# EAGLE design MeshPi (EAGLE 7.7.0)
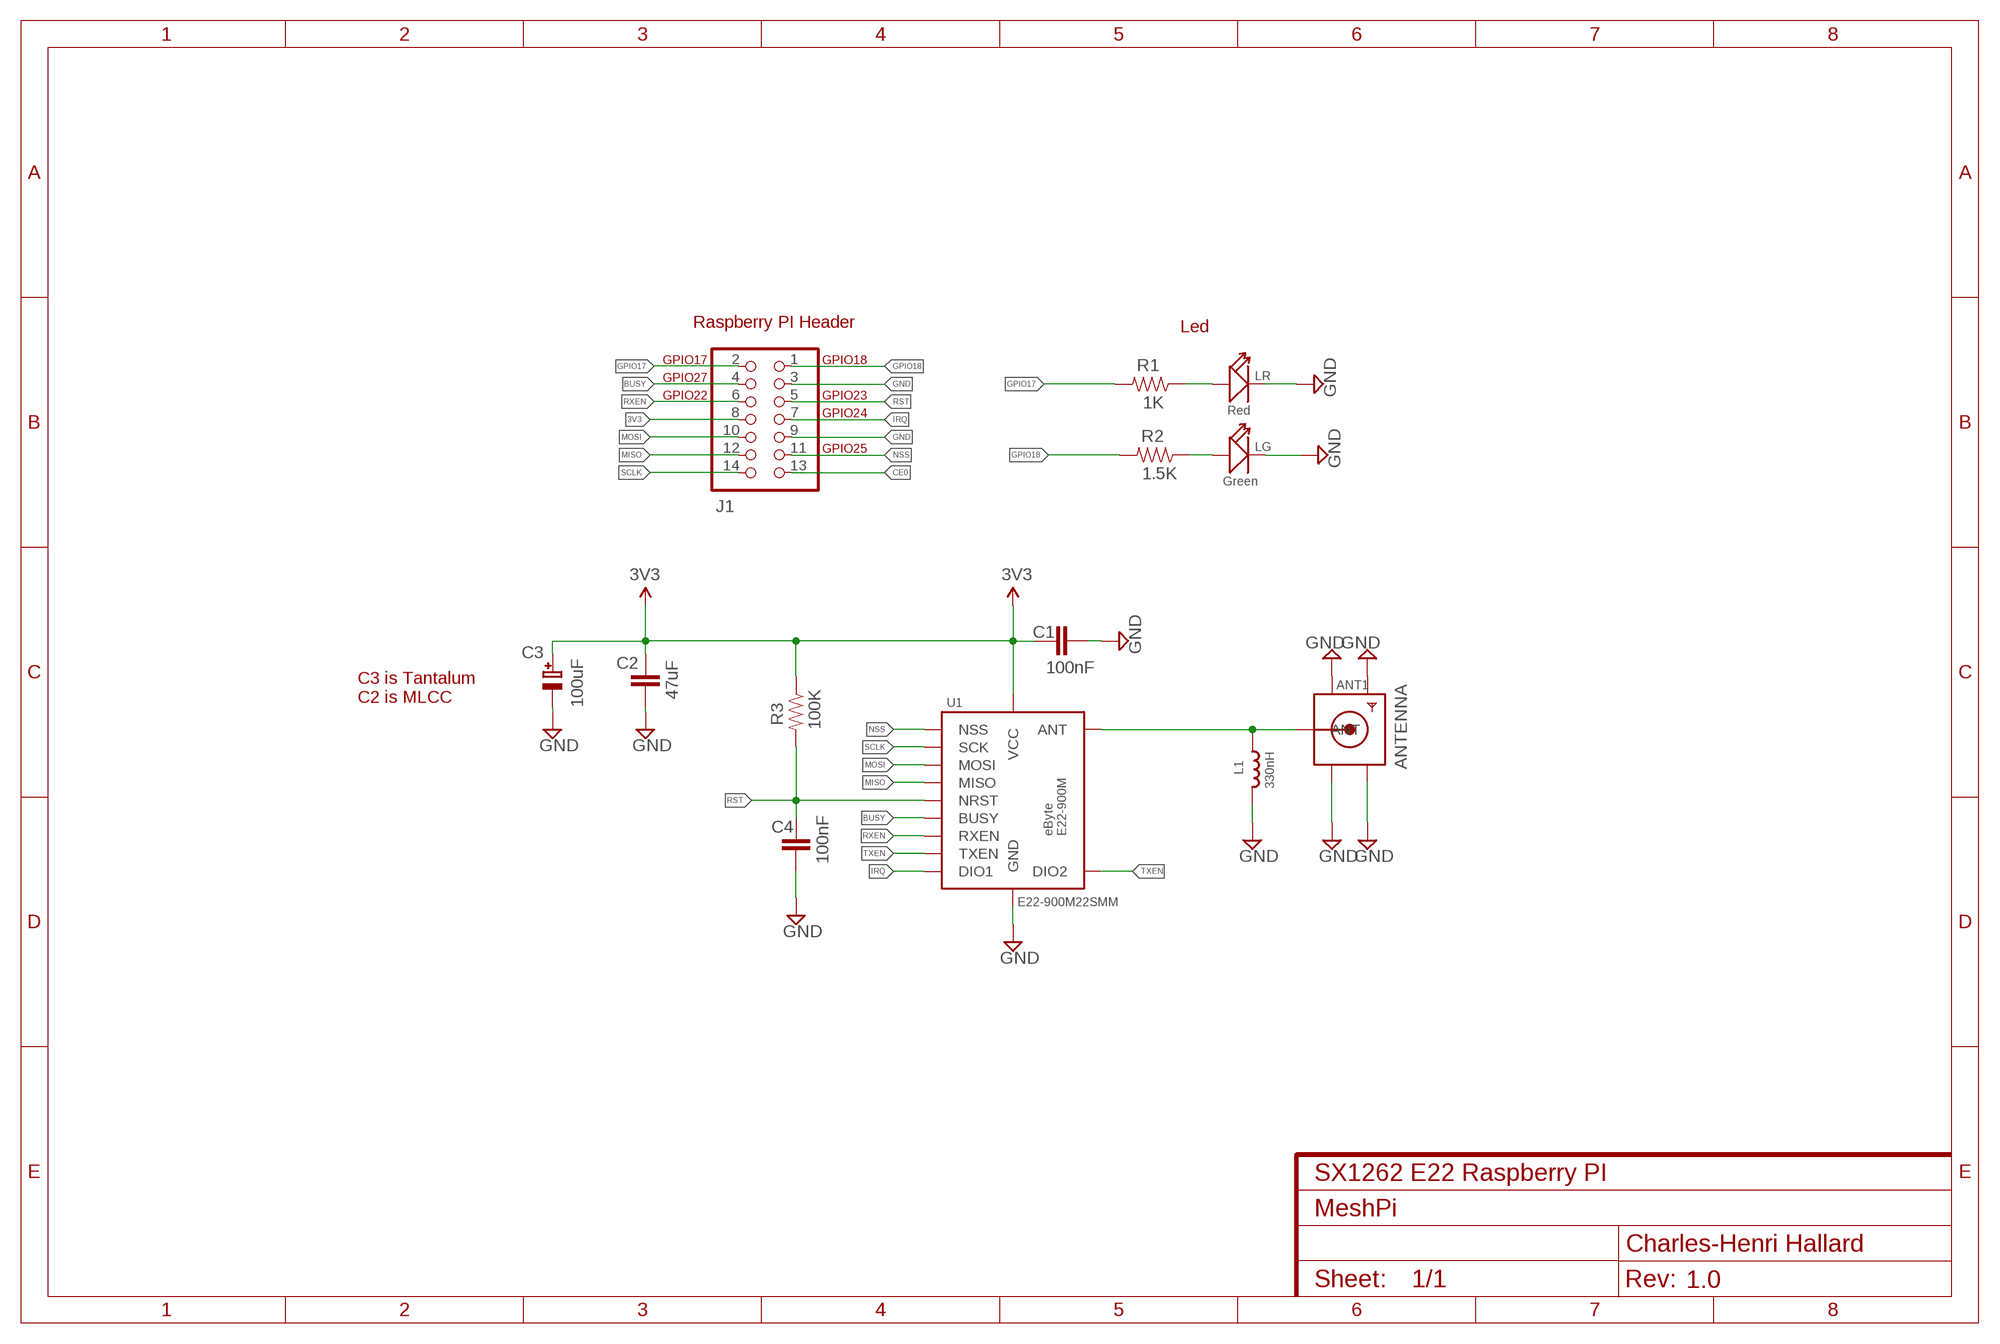
[diagram p0: schematic, sheet 1]
NAME (FRAME-A4L): CNAME: SX1262 E22 Raspberry PI; CREVISION: 1.0; DESIGNER: Charles-Henri Hallard

## Parts
ANT1  SMACONNECTOR_EDGE_UFL  [SMA_EDGELAUNCH_UFL]
C1  100nF  CAP0402-CAP  [0402-CAP]
C2  47uF  CAP1206  [1206]
C3  100uF  CAP_TANTALUMB/3528_REFLOW  [EIA3528-21/B-R]
C4  100nF  CAP0402-CAP  [0402-CAP]
J1  PINHD-2X7  [2X07]
L1  330nH  INDUCTOR_0603MP  [_0603MP]
LG  Green  SMD-LED-CLEAR-BLUE(0402)  [LED-0402]
LR  Red  SMD-LED-CLEAR-BLUE(0402)  [LED-0402]
R1  1K  RESISTOR0402-RES  [0402-RES]
R2  1.5K  RESISTOR0402-RES  [0402-RES]
R3  100K  RESISTOR0402-RES  [0402-RES]
U1  E22-900M22SMM  [E22-900MM2S]

## Nets
3V3: C1.2 C2.2 C3.+ J1.8 R3.1 U1.P$1(VCC)
ANTENNA: ANT1.P(ANT) L1.1 U1.P$6(ANT)
BUSY: J1.4 U1.P$11(BUSY)
CE0: J1.13
GND: ANT1.GND@1(GND1) ANT1.GND@2(GND2) ANT1.GND@3(GND3) ANT1.GND@4(GND4) C1.1 C2.1 C3.- C4.1 J1.3 J1.9 L1.2 LG.- LR.- U1.P$2(GND) U1.P$7(GND) U1.P$16(GND)
GPIO17: J1.2 R1.2
GPIO18: J1.1 R2.2
IRQ: J1.7 U1.P$20(DIO1)
MISO: J1.12 U1.P$12(MISO)
MOSI: J1.10 U1.P$13(MOSI)
N$1: LR.+ R1.1
N$2: LG.+ R2.1
NSS: J1.11 U1.P$14(NSS)
RST: C4.2 J1.5 R3.2 U1.P$3(NRST)
RXEN: J1.6 U1.P$10(RXEN)
SCLK: J1.14 U1.P$15(SCK)
TXEN: U1.P$9(TXEN) U1.P$19(DIO2)

## Notes on the sheet
- Raspberry PI Header | Led
- GPIO17 | GPIO18
- GPIO27
- GPIO22 | GPIO23
- GPIO24
- GPIO25
- C3 is Tantalum
  C2 is MLCC

## Library data of the parts
ANT1 = adafruit:SMACONNECTOR: SMA Connector 90° DIP SMA Connector, 50 Ohm (4UConnector: 07259)
C1 C2 C4 = _c2h:CAP: Capacitor Standard 0603 ceramic capacitor, and 0.1" leaded capacitor.
C3 = microbuilder:CAP_TANTALUM: Tantalum Capacitors Wave footprints have larger pads and are meant to be used for hand soldering. Reflow footprints are optimised for solder paste and a reflow oven. EIA3216-18/A-[R/W] - Size A / 3216-18 / 1206 footprint 4.7µF 25V 10% Tantalum Capacitor 10µF 16V 10% Tantalum Capacitor [Digikey: 495-2236-2-ND] EIA3528-21/B-[R/W] - Size B / 3528-21 47µF 10V 10% Tantalum Capactior [Digikey: 495-2216-1-ND] EIA6032-28/C-[R/W] - Size C / 6032-28 10µF 35V 20% Tantalum Capacitor [Digikey: 495-2285-1-ND] 100µF 16V 10% Tantalum Capactior [Digikey: 399-5214-1-ND]
J1 = pinhead:PINHD-2X7: PIN HEADER
L1 = microbuilder:INDUCTOR: Inductors 0603: 10nH Ceramic Inductor - microwire antenna/RF (Digikey: 712-1434-2-ND) 0805: 560nH Ceramic Inductor - RF (Digikey: 553-1047-1-ND) 270nH Ceramic Inductor - Q = 40@250MHz, +-5%, 1 Ohm DC Resistance (Digikey: 535-10506-2-ND) 1007 (2518 Metric) SMT: 10µH 10% 250mOhm 820mA 1007 Inductor (Digikey: 587-2189-1-ND) 22µH 10% 500mOhm 580mA 1007 Inductor (Digikey: 587-2190-1-ND) 47µH 10% 950mOhm 420mA 1007 Inductor (Digikey: 587-2191-1-ND) 47µH 5% 100mOhm 1A 1008 Inductor (Digikey: 732-1816-1-ND) 5.0x5.0mm (Taiyo Yuden NR5040 Series) 6.8µH 20% 2.3A 64mOhm Inductor (Digikey: 587-2374-2-ND) 5.0x5.0mm (TDK VLC5045 Series) 4.7µH 20% 3.3A 34mOhm Inductor (Digikey: 445-6526-1-ND) 6.8µH 20% 2.7A 46mOhm Inductor (Digikey: 445-6527-1-ND) 6.0x6.0mm (TDK VLC6045 Series) 4.7µH 20% 3.8A 27mOhm Inductor (Digikey: 445-6538-2-ND) 6.8µH 20% 3A 41mOhm Inductor (Digikey: 445-6540-1-ND) 6.2µH 30% 2.2A 45mOhm Inductor (Digikey: SRR5028-6R2YCT-ND) - Not TDK VLC6045 but footprint should match 6.0x6.0mm (TDK SLF6045 Series) 6.8uH 30% 2A 33mOhm Inductor (Digikey: 445-4572-1-ND, Mouser: 810-SLF645T6R8N2R0PF)
LG LR = OPL_Optoelectronics:SMD-LED-CLEAR-BLUE(0402): 304090075; MPN: BL-HB337A-AV-TRB; VALUE: BLUE-0402
R1-R3 = _c2h:RESISTOR: Resistor Basic schematic elements and footprints for 0603, 1206, and PTH resistors.
U1 = E22-900M22S:E22-900M22S: Check availability <https://pricing.snapeda.com/parts/E22-900M22S/EBYTE/view-part?ref=eda>

## Board
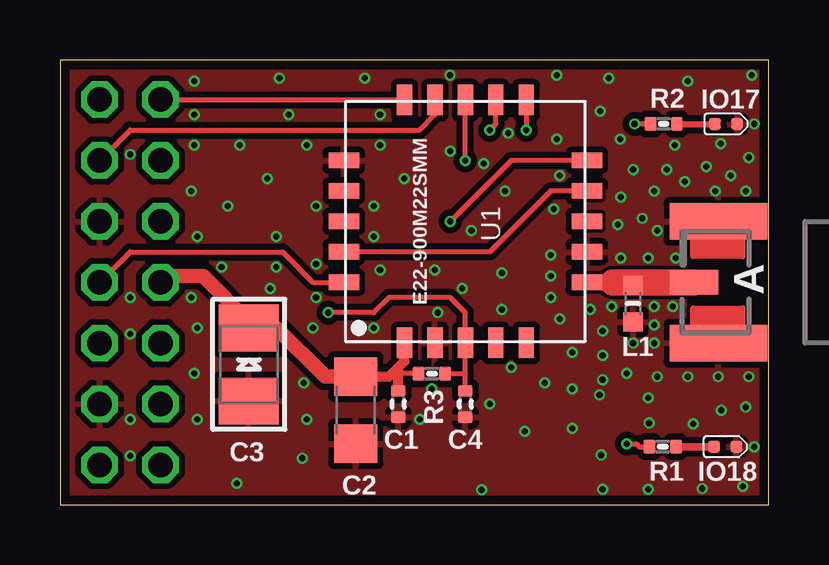
[diagram p1: board, top side]
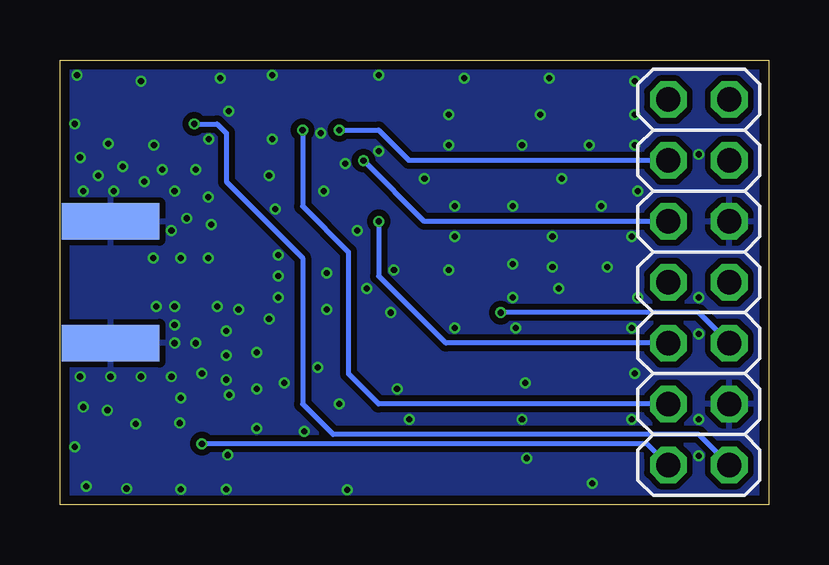
[diagram p2: board, bottom side, seen from below]

Size 29.54 x 18.54 mm. Coordinates in mm from the lower left corner, seen from the top.
Outline: 0,0 29.54,0 29.54,18.54 0,18.54 0,0
Copper layers (1*16): Top 0.035559375mm / dielectric 0.17018125mm / Bottom 0.035559375mm
Design rules "oshpark-4layer-tented *": minimum track width 5mil, minimum drill 10mil, track to track 5mil, track to pad 5mil, pad to pad 5mil, via to via 5mil, smd to smd 5mil, copper to edge 15mil, drill to drill 6mil, minimum pad ring 4mil, minimum via ring 4mil, stop-mask expansion 1.5mil, vias tented up to drill 20mil, thermal gap 10mil

### Footprints (pad centres in the part's own frame; a part is rotated, then mirrored left to right if it is on the bottom)
SMA_EDGELAUNCH_UFL = smd 4.064 x 1.524: GND@1 2.032,-2.54; GND@2 2.032,2.54 | smd 4.064 x 1.524 bottom: GND@3 2.032,2.54; GND@4 2.032,-2.54 | smd 2.032 x 1.016: P 3.048,0
0402-CAP = smd 0.5 x 0.6: 1 -0.55,0; 2 0.55,0
1206 = smd 1.6 x 1.8: 1 -1.4,0; 2 1.4,0
EIA3528-21/B-R = smd 1.95 x 2.5: + 1.525,0; - -1.525,0
2X07 = drill 1.016 octagon: 1 -7.62,-1.27; 2 -7.62,1.27; 3 -5.08,-1.27; 4 -5.08,1.27; 5 -2.54,-1.27; 6 -2.54,1.27; 7 0,-1.27; 8 0,1.27; 9 2.54,-1.27; 10 2.54,1.27; 11 5.08,-1.27; 12 5.08,1.27; 13 7.62,-1.27; 14 7.62,1.27
_0603MP = smd 0.8 x 0.8: 1 -0.762,0; 2 0.762,0
LED-0402 = smd 0.5 x 0.5: + -0.463,0; - 0.463,0
0402-RES = smd 0.5 x 0.6: 1 -0.55,0; 2 0.55,0
E22-900MM2S = smd 1.27 x 0.635: P$1 -5.062,2.54; P$2 -5.062,1.27; P$3 -5.062,0; P$4 -5.062,-1.27; P$5 -5.062,-2.54; P$11 5.062,-2.54; P$12 5.062,-1.27; P$13 5.062,0; P$14 5.062,1.27; P$15 5.062,2.54 | smd 0.635 x 1.27: P$6 -2.54,-5.062; P$7 -1.27,-5.062; P$8 0,-5.062; P$9 1.27,-5.062; P$10 2.54,-5.062; P$16 2.54,5.062; P$17 1.27,5.062; P$18 0,5.062; P$19 -1.27,5.062; P$20 -2.54,5.062

### Placement (x,y rotation side)
ANT1  29.46,9.27 180 top
C1  14.1,4.19 90 top
C2  12.32,3.94 90 top
C3  7.87,5.84 90 top
C4  16.89,4.19 90 top
J1  2.92,9.27 90 bottom
L1  23.88,8.38 270 top
LG  27.75,15.88 0 top
LR  27.72,2.41 0 top
R1  25.11,2.41 180 top
R2  25.15,15.88 180 top
R3  15.49,5.46 0 top
U1  16.89,11.81 90 top

### Tracks (layer width: path | path; a pad name or v marks a point on that pad's centre or on a via)
3V3
  Top 0.203: R3.1 14.1,5.46
  Top 0.406: 12.82,5.33 13.72,5.33 14.1,5.72 | U1.P$1 14.35,5.97 14.1,5.72 | C1.2 14.1,5.46 14.1,5.72
  Top 0.61: C2.2 12.82,5.33 11.05,5.33 9.02,7.37 C3.+ 7.87,7.62 5.97,9.53 4.45,9.53 J1.8
ANTENNA
  Top 0.203: L1.1 23.88,9.27
  Top 0.61: U1.P$6 23.05,9.27
  Top 1.095: ANT1.P 23.88,9.27 23.05,9.27
BUSY  (via drill 0.25)
  Top 0.203: U1.P$11 v19.43,15.62
  Bottom 0.203: v19.43,15.62 19.43,12.45 17.53,10.54 17.53,5.46 16.26,4.19 J1.4
GND  (via drill 0.25)
  other vias: 21.34,6.35 23.37,12.83 22.61,6.22 22.61,5.21 21.34,4.83 21.34,3.18 20.7,15.24 28.83,17.91 24.26,11.94 24.77,8.26 22.1,8.13 22.99,8.26 23.37,10.29 28.7,14.48 20.45,10.41 20.45,9.53 20.45,8.64 20.83,7.75 22.61,7.24 28.7,5.33 27.43,5.33 26.16,5.33 24.89,5.33 24.77,6.73 27.56,3.94 24.51,4.45 28.57,4.06 22.48,4.57 23.62,5.46 24.51,10.29 23.88,13.97 23.34,15.24 25.62,14.99 28.57,13.08 27.3,13.08 26.03,13.46 24.77,13.08 7.37,0.89 5.59,5.46 13.08,7.37 10.16,5.08 15.75,8 18.8,5.72 17.91,4.19 20.19,5.08 6.73,9.91 10.67,10.03 13.33,9.78 9.02,9.91 10.67,8.64 13.08,11.18 13.33,14.99 10.29,14.99 5.46,13.08 7.49,14.99 5.59,16.26 5.59,17.65 16.25,17.91 13.33,16.26 9.53,16.26 12.7,17.78 9.14,17.78 10.67,12.45 9.02,11.18 8.64,13.59 16.26,14.73 14.35,13.59 13.08,12.45 17.65,14.22 20.7,17.91 16.76,9.02 17.15,11.43 20.83,13.72 18.54,13.08 18.41,9.65 18.41,8.13 20.57,12.32 24.51,0.64 22.61,0.64 26.38,3.37 10.1,1.94 25.65,10.29 25.53,8.26 28.92,15.88 22.86,17.78 25.27,13.97 26.92,14.1 27.94,13.72 27.53,15.05 22.51,16.41 23.88,6.73 24.77,7.49 24.89,11.43 23.24,11.68 2.92,2.03 2.92,3.56 2.92,7.11 2.92,8.64 10.29,3.56 5.72,3.56 5.72,7.37 5.72,11.18 5.59,14.99 14.99,3.56 26.16,17.65 17.56,0.62 18.67,15.49 8.76,9.02 10.54,7.37 5.46,8.64 2.92,14.61 22.54,2.06 26.77,0.67 24.54,3.4 28.45,0.76 19.37,3.05 6.99,12.45 15.62,9.78 28.92,2.41 15.49,4.83
  pour Bottom (isolate 0.254): -1.52,20.07 30.86,20.07 30.86,-1.52 -1.52,-1.52
  pour Top (isolate 0.254): -0.89,19.43 30.23,19.43 30.23,12.45 21.97,12.45 21.97,6.1 30.23,6.1 30.23,-0.89 -0.89,-0.89
  pour Top (isolate 0.15): 21.97,13.08 21.97,5.46 30.23,5.46 30.23,13.08
GPIO17  (via drill 0.25)
  Top 0.203: v23.62,2.54 24,2.54 24.13,2.41 R1.2
  Bottom 0.203: J1.2 5.08,2.54 v23.62,2.54
GPIO18  (via drill 0.25)
  Top 0.203: R2.2 v23.94,15.88
  Bottom 0.203: v23.94,15.88 22.99,15.88 22.61,15.49 22.61,13.46 19.43,10.29 19.43,4.19 18.16,2.92 2.92,2.92 J1.1
IRQ
  Top 0.203: J1.7 2.92,10.54 9.27,10.54 10.54,9.27 U1.P$20
MISO  (via drill 0.25)
  Top 0.203: v17.91,15.62 18.16,15.88 U1.P$12
  Bottom 0.203: J1.12 14.99,14.35 16.26,15.62 v17.91,15.62
MOSI  (via drill 0.25)
  Top 0.203: v16.89,14.35 U1.P$13
  Bottom 0.203: J1.10 14.35,11.81 v16.89,14.35
N$1
  Top 0.305: R1.1 LR.+
N$2
  Top 0.254: R2.1 LG.+
NSS
  Top 0.203: U1.P$14 15.62,16.26 14.99,15.62 2.92,15.62 J1.11
RST  (via drill 0.25)
  Top 0.203: v11.18,8 13.08,8 13.72,8.64 16.26,8.64 16.89,8 U1.P$3 16.89,5.46 | C4.2 16.89,5.46 | R3.2 16.89,5.46
  Bottom 0.203: J1.5 2.92,8 v11.18,8
RXEN  (via drill 0.25)
  Top 0.203: U1.P$10 18.8,14.35 v16.26,11.81
  Bottom 0.203: v16.26,11.81 16.26,9.53 13.46,6.73 J1.6
SCLK
  Top 0.203: U1.P$15 14.33,16.89 J1.14
TXEN
  Top 0.203: U1.P$9 20.45,13.08 17.91,10.54 U1.P$19

### Text on the board
tPlace: IO17 | A | IO18
tStop: V1.0 | Mesh PI
bStop: V1.0 | Mesh PI | github.com/hallard